# Altium schematic sheet psu_and_discharge.SchDoc: PSU:s
size A3; Organization: GPA Robotics; DocumentNumber: 7; Revision: REV 0; SheetNumber: 7; SheetTotal: 11
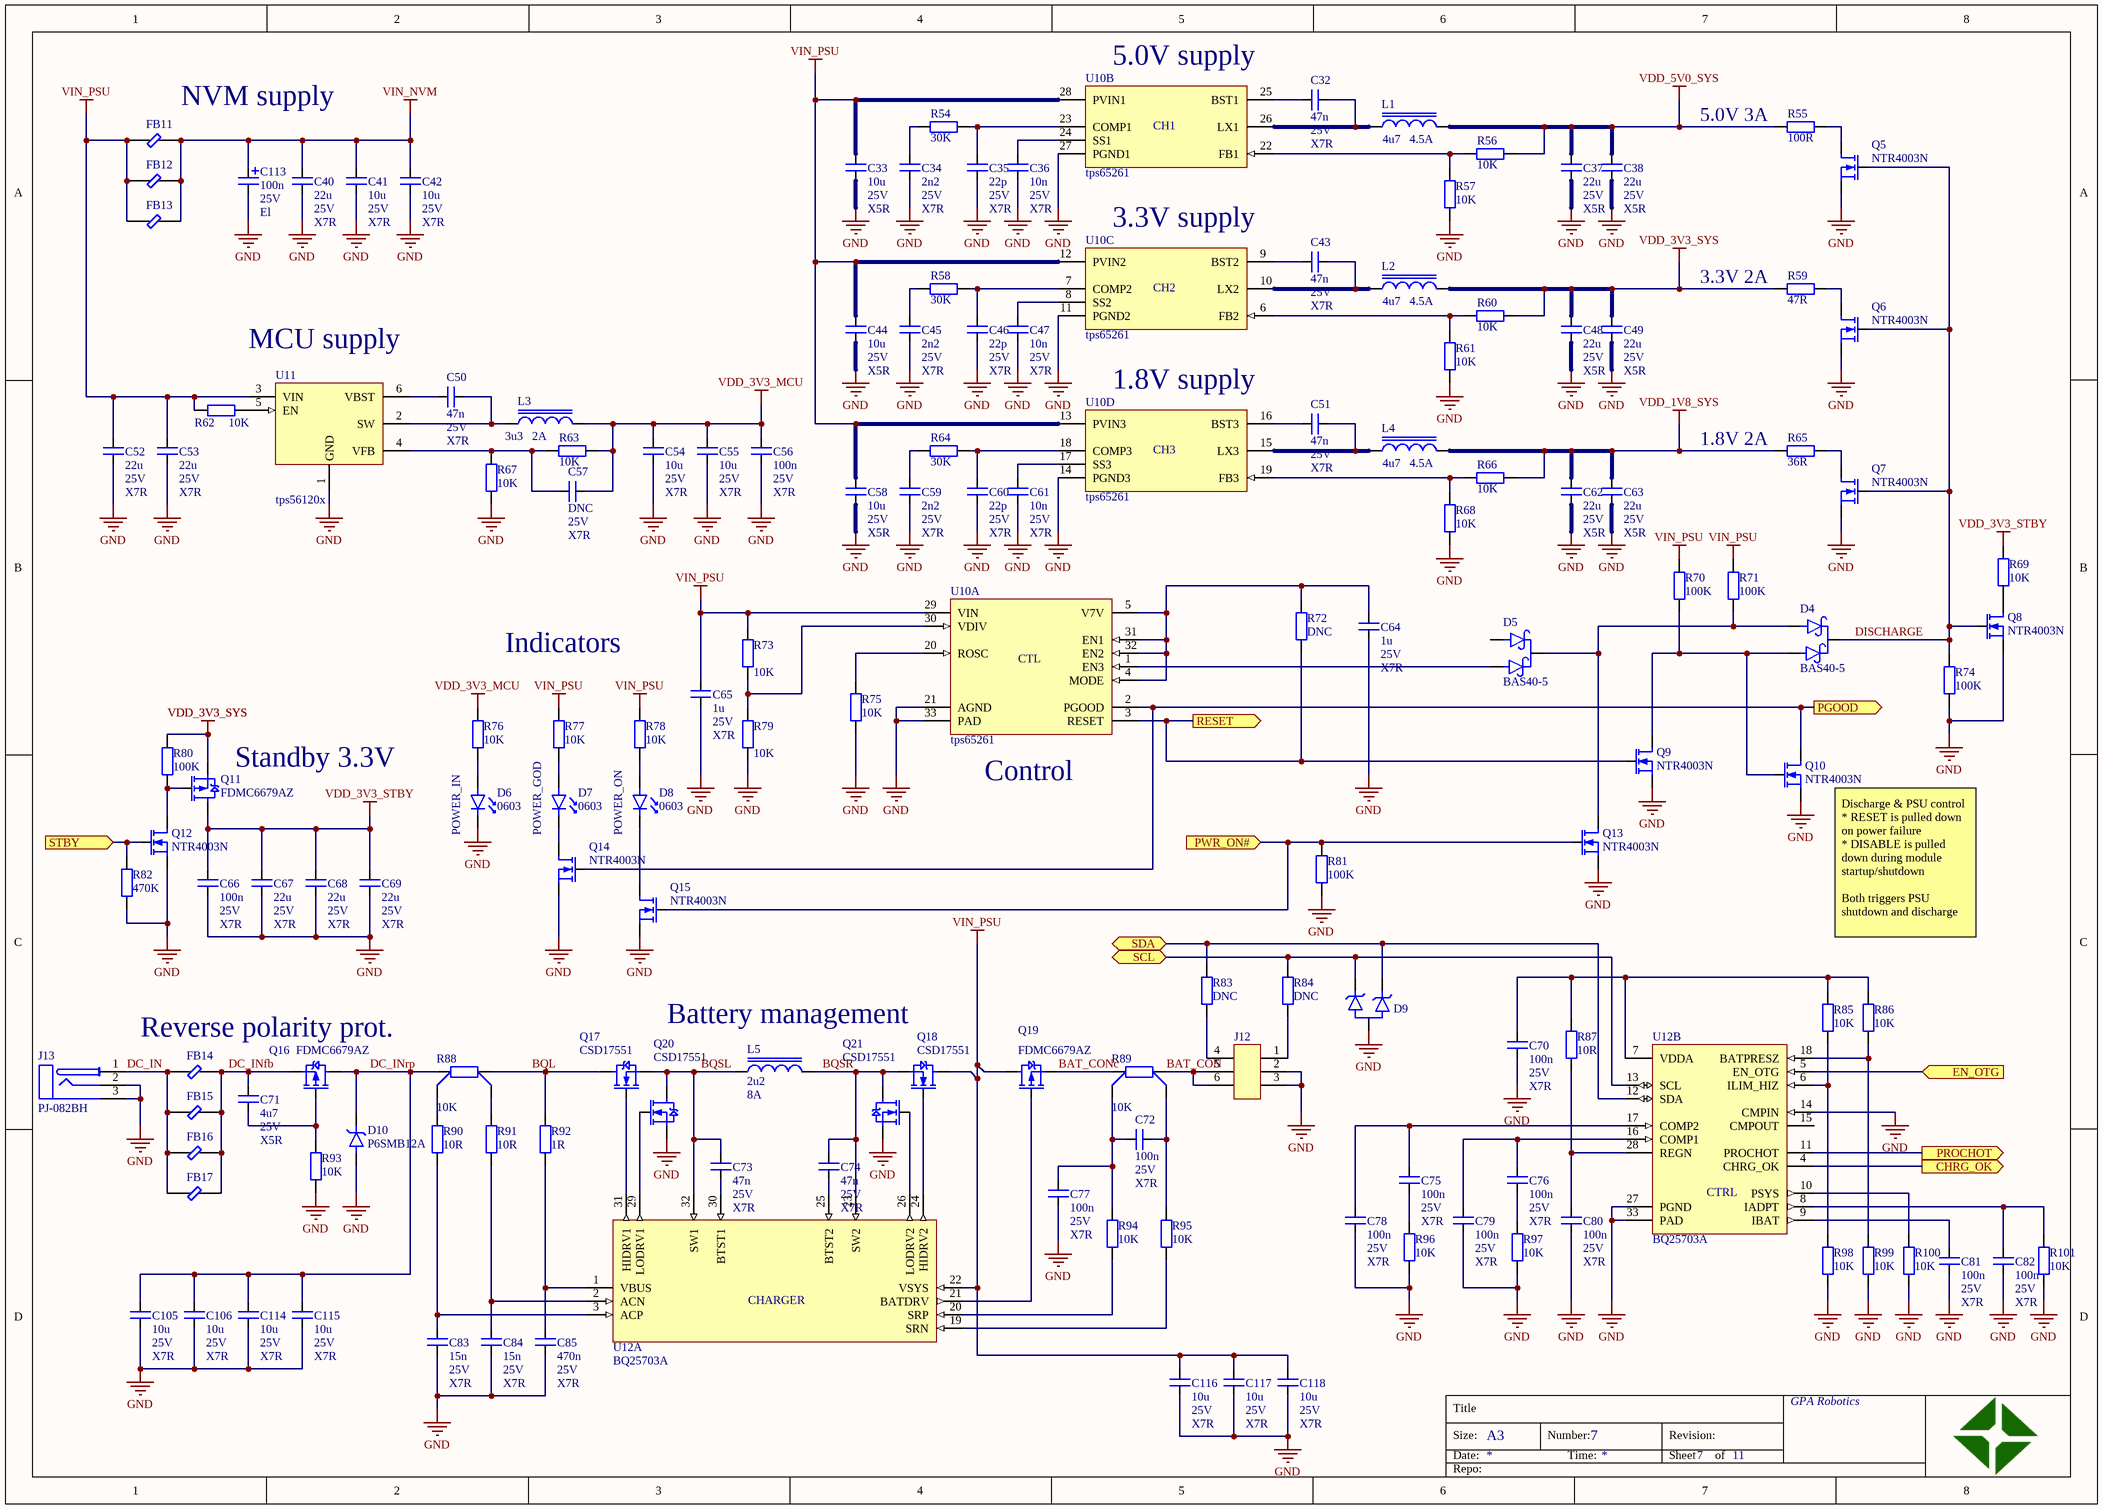
[diagram p0: psu_and_discharge.SchDoc]

## Parts
C32  value 47n  Voltage: 25V  Type: X7R  [C1005[0402]]  (hidden comment: cap)
C33  value 10u  Voltage: 25V  Type: X5R  [C3216[1206]]  (hidden comment: cap)
C34  value 2n2  Voltage: 25V  Type: X7R  [C1005[0402]]  (hidden comment: cap)
C35  value 22p  Voltage: 25V  Type: X7R  [C1005[0402]]  (hidden comment: cap)
C36  value 10n  Voltage: 25V  Type: X7R  [C1005[0402]]  (hidden comment: cap)
C37  value 22u  Voltage: 25V  Type: X5R  [C3216[1206]]  (hidden comment: cap)
C38  value 22u  Voltage: 25V  Type: X5R  [C3216[1206]]  (hidden comment: cap)
C40  value 22u  Voltage: 25V  Type: X7R  [C3216[1206]]  (hidden comment: cap)
C41  value 10u  Voltage: 25V  Type: X7R  [C3216[1206]]  (hidden comment: cap)
C42  value 10u  Voltage: 25V  Type: X7R  [C3216[1206]]  (hidden comment: cap)
C43  value 47n  Voltage: 25V  Type: X7R  [C1005[0402]]  (hidden comment: cap)
C44  value 10u  Voltage: 25V  Type: X5R  [C3216[1206]]  (hidden comment: cap)
C45  value 2n2  Voltage: 25V  Type: X7R  [C1005[0402]]  (hidden comment: cap)
C46  value 22p  Voltage: 25V  Type: X7R  [C1005[0402]]  (hidden comment: cap)
C47  value 10n  Voltage: 25V  Type: X7R  [C1005[0402]]  (hidden comment: cap)
C48  value 22u  Voltage: 25V  Type: X5R  [C3216[1206]]  (hidden comment: cap)
C49  value 22u  Voltage: 25V  Type: X5R  [C3216[1206]]  (hidden comment: cap)
C50  value 47n  Voltage: 25V  Type: X7R  [C1005[0402]]  (hidden comment: cap)
C51  value 47n  Voltage: 25V  Type: X7R  [C1005[0402]]  (hidden comment: cap)
C52  value 22u  Voltage: 25V  Type: X7R  [C3216[1206]]  (hidden comment: cap)
C53  value 22u  Voltage: 25V  Type: X7R  [C3216[1206]]  (hidden comment: cap)
C54  value 10u  Voltage: 25V  Type: X7R  [C3216[1206]]  (hidden comment: cap)
C55  value 10u  Voltage: 25V  Type: X7R  [C3216[1206]]  (hidden comment: cap)
C56  value 100n  Voltage: 25V  Type: X7R  [C1005[0402]]  (hidden comment: cap)
C57  value DNC  Voltage: 25V  Type: X7R  [C1005[0402]]  (hidden comment: cap)
C58  value 10u  Voltage: 25V  Type: X5R  [C3216[1206]]  (hidden comment: cap)
C59  value 2n2  Voltage: 25V  Type: X7R  [C1005[0402]]  (hidden comment: cap)
C60  value 22p  Voltage: 25V  Type: X7R  [C1005[0402]]  (hidden comment: cap)
C61  value 10n  Voltage: 25V  Type: X7R  [C1005[0402]]  (hidden comment: cap)
C62  value 22u  Voltage: 25V  Type: X5R  [C3216[1206]]  (hidden comment: cap)
C63  value 22u  Voltage: 25V  Type: X5R  [C3216[1206]]  (hidden comment: cap)
C64  value 1u  Voltage: 25V  Type: X7R  [C2012[0805]]  (hidden comment: cap)
C65  value 1u  Voltage: 25V  Type: X7R  [C2012[0805]]  (hidden comment: cap)
C66  value 100n  Voltage: 25V  Type: X7R  [C1005[0402]]  (hidden comment: cap)
C67  value 22u  Voltage: 25V  Type: X7R  [C3216[1206]]  (hidden comment: cap)
C68  value 22u  Voltage: 25V  Type: X7R  [C3216[1206]]  (hidden comment: cap)
C69  value 22u  Voltage: 25V  Type: X7R  [C3216[1206]]  (hidden comment: cap)
C70  value 100n  Voltage: 25V  Type: X7R  [C1005[0402]]  (hidden comment: cap)
C71  value 4u7  Voltage: 25V  Type: X5R  [C1005[0402]]  (hidden comment: cap)
C72  value 100n  Voltage: 25V  Type: X7R  [C1005[0402]]  (hidden comment: cap)
C73  value 47n  Voltage: 25V  Type: X7R  [C1005[0402]]  (hidden comment: cap)
C74  value 47n  Voltage: 25V  Type: X7R  [C1005[0402]]  (hidden comment: cap)
C75  value 100n  Voltage: 25V  Type: X7R  [C1005[0402]]  (hidden comment: cap)
C76  value 100n  Voltage: 25V  Type: X7R  [C1005[0402]]  (hidden comment: cap)
C77  value 100n  Voltage: 25V  Type: X7R  [C1005[0402]]  (hidden comment: cap)
C78  value 100n  Voltage: 25V  Type: X7R  [C1005[0402]]  (hidden comment: cap)
C79  value 100n  Voltage: 25V  Type: X7R  [C1005[0402]]  (hidden comment: cap)
C80  value 100n  Voltage: 25V  Type: X7R  [C1005[0402]]  (hidden comment: cap)
C81  value 100n  Voltage: 25V  Type: X7R  [C1005[0402]]  (hidden comment: cap)
C82  value 100n  Voltage: 25V  Type: X7R  [C1005[0402]]  (hidden comment: cap)
C83  value 15n  Voltage: 25V  Type: X7R  [C1005[0402]]  (hidden comment: cap)
C84  value 15n  Voltage: 25V  Type: X7R  [C1005[0402]]  (hidden comment: cap)
C85  value 470n  Voltage: 25V  Type: X7R  [C1005[0402]]  (hidden comment: cap)
C105  value 10u  Voltage: 25V  Type: X7R  [C3216[1206]]  (hidden comment: cap)
C106  value 10u  Voltage: 25V  Type: X7R  [C3216[1206]]  (hidden comment: cap)
C113  value 100n  Voltage: 25V  Type: El  [CAPAE7366X55M]  (hidden comment: pcap)
C114  value 10u  Voltage: 25V  Type: X7R  [C3216[1206]]  (hidden comment: cap)
C115  value 10u  Voltage: 25V  Type: X7R  [C3216[1206]]  (hidden comment: cap)
C116  value 10u  Voltage: 25V  Type: X7R  [C3216[1206]]  (hidden comment: cap)
C117  value 10u  Voltage: 25V  Type: X7R  [C3216[1206]]  (hidden comment: cap)
C118  value 10u  Voltage: 25V  Type: X7R  [C3216[1206]]  (hidden comment: cap)
D4  BAS40-5  [DCC_SOT95P235X110-3N]
D5  BAS40-5  [DCC_SOT95P235X110-3N]
D6  0603  [LEDC1608X06N]
D7  0603  [LEDC1608X06N]
D8  0603  [LEDC1608X06N]
D9  Zener  [DCA_SOT95P235X110-3N]  (value not drawn)
D10  P6SMB12A  [SMA_DIOM5226X22N]
FB11  2506036007Y3  [FBC1608X07N]  (value not drawn)
FB12  2506036007Y3  [FBC1608X07N]  (value not drawn)
FB13  2506036007Y3  [FBC1608X07N]  (value not drawn)
FB14  2506036007Y3  [FBC1608X07N]  (value not drawn)
FB15  2506036007Y3  [FBC1608X07N]  (value not drawn)
FB16  2506036007Y3  [FBC1608X07N]  (value not drawn)
FB17  2506036007Y3  [FBC1608X07N]  (value not drawn)
J12  43045-0600  [molex_microfit_2x6_90deg]  (value not drawn)
J13  PJ-082BH  [CUI_DC_5.5MM_PJ028]
L1  value 4u7  Current: 4.5A  [BOURNS_SRN6045TA-XXX]  (hidden comment: ASPI-0630LR-XXXM-T15)
L2  value 4u7  Current: 4.5A  [BOURNS_SRN6045TA-XXX]  (hidden comment: ASPI-0630LR-XXXM-T15)
L3  value 3u3  Current: 2A  [YUDEN_NRS4018T-XXXMDGJ]  (hidden comment: ASPI-0630LR-XXXM-T15)
L4  value 4u7  Current: 4.5A  [BOURNS_SRN6045TA-XXX]  (hidden comment: ASPI-0630LR-XXXM-T15)
L5  value 2u2  Current: 8A  [VISHAY_IHLM2525CZERXXXM01]  (hidden comment: ASPI-0630LR-XXXM-T15)
Q5  NTR4003N  [NCH_SOT95P237X110-3N]
Q6  NTR4003N  [NCH_SOT95P237X110-3N]
Q7  NTR4003N  [NCH_SOT95P237X110-3N]
Q8  NTR4003N  [NCH_SOT95P237X110-3N]
Q9  NTR4003N  [NCH_SOT95P237X110-3N]
Q10  NTR4003N  [NCH_SOT95P237X110-3N]
Q11  FDMC6679AZ  [NCH_SON65P330X80_HS-9N]
Q12  NTR4003N  [NCH_SOT95P237X110-3N]
Q13  NTR4003N  [NCH_SOT95P237X110-3N]
Q14  NTR4003N  [NCH_SOT95P237X110-3N]
Q15  NTR4003N  [NCH_SOT95P237X110-3N]
Q16  FDMC6679AZ  [NCH_SON65P330X80_HS-9N]
Q17  CSD17551  [NCH_SON65P330X80_HS-9N]
Q18  CSD17551  [NCH_SON65P330X80_HS-9N]
Q19  FDMC6679AZ  [NCH_SON65P330X80_HS-9N]
Q20  CSD17551  [NCH_SON65P330X80_HS-9N]
Q21  CSD17551  [NCH_SON65P330X80_HS-9N]
R54  value 30K  [R1005[0402]]  (hidden comment: res)
R55  value 100R  [R1005[0402]]  (hidden comment: res)
R56  value 10K  [R1005[0402]]  (hidden comment: res)
R57  value 10K  [R1005[0402]]  (hidden comment: res)
R58  value 30K  [R1005[0402]]  (hidden comment: res)
R59  value 47R  [R1005[0402]]  (hidden comment: res)
R60  value 10K  [R1005[0402]]  (hidden comment: res)
R61  value 10K  [R1005[0402]]  (hidden comment: res)
R62  value 10K  [R1005[0402]]  (hidden comment: res)
R63  value 10K  [R1005[0402]]  (hidden comment: res)
R64  value 30K  [R1005[0402]]  (hidden comment: res)
R65  value 36R  [R1005[0402]]  (hidden comment: res)
R66  value 10K  [R1005[0402]]  (hidden comment: res)
R67  value 10K  [R1005[0402]]  (hidden comment: res)
R68  value 10K  [R1005[0402]]  (hidden comment: res)
R69  value 10K  [R1005[0402]]  (hidden comment: res)
R70  value 100K  [R1005[0402]]  (hidden comment: res)
R71  value 100K  [R1005[0402]]  (hidden comment: res)
R72  value DNC  [R1005[0402]]  (hidden comment: res)
R73  value 10K  [R1005[0402]]  (hidden comment: res)
R74  value 100K  [R1005[0402]]  (hidden comment: res)
R75  value 10K  [R1005[0402]]  (hidden comment: res)
R76  value 10K  [R1005[0402]]  (hidden comment: res)
R77  value 10K  [R1005[0402]]  (hidden comment: res)
R78  value 10K  [R1005[0402]]  (hidden comment: res)
R79  value 10K  [R1005[0402]]  (hidden comment: res)
R80  value 100K  [R1005[0402]]  (hidden comment: res)
R81  value 100K  [R1005[0402]]  (hidden comment: res)
R82  value 470K  [R1005[0402]]  (hidden comment: res)
R83  value DNC  [R1005[0402]]  (hidden comment: res)
R84  value DNC  [R1005[0402]]  (hidden comment: res)
R85  value 10K  [R1005[0402]]  (hidden comment: res)
R86  value 10K  [R1005[0402]]  (hidden comment: res)
R87  value 10R  [R1005[0402]]  (hidden comment: res)
R88  value 10K  [4W_R320P320X90-4N]  (hidden comment: res_sens)
R89  value 10K  [4W_R320P320X90-4N]  (hidden comment: res_sens)
R90  value 10R  [R1005[0402]]  (hidden comment: res)
R91  value 10R  [R1005[0402]]  (hidden comment: res)
R92  value 1R  [R1005[0402]]  (hidden comment: res)
R93  value 10K  [R1005[0402]]  (hidden comment: res)
R94  value 10K  [R1005[0402]]  (hidden comment: res)
R95  value 10K  [R1005[0402]]  (hidden comment: res)
R96  value 10K  [R1005[0402]]  (hidden comment: res)
R97  value 10K  [R1005[0402]]  (hidden comment: res)
R98  value 10K  [R1005[0402]]  (hidden comment: res)
R99  value 10K  [R1005[0402]]  (hidden comment: res)
R100  value 10K  [R1005[0402]]  (hidden comment: res)
R101  value 10K  [R1005[0402]]  (hidden comment: res)
U10  tps65261  [TI_QFN50P500X500X100_HS-33M]  (parts A,B,C,D of 4)
U11  tps56120x  [TI_SOT95P280X110-6N]
U12  BQ25703A  [TI_QFN40P400X400X80_HS-33M]  (parts A,B of 2)

## Ports
CHRG_OK (out), EN_OTG (in), PGOOD (out), PROCHOT (out), PWR_ON# (in), RESET (out), SCL (bidir), SDA (bidir), STBY (in)

## Nets
GND: C33.1 C34.1 C35.1 C36.1 C37.1 C38.1 C40.1 C41.1 C42.1 C44.1 C45.1 C46.1 C47.1 C48.1 C49.1 C52.1 C53.1 C54.1 C55.1 C56.1 C58.1 C59.1 C60.1 C61.1 C62.1 C63.1 C64.1 C65.1 C66.1 C67.1 C68.1 C69.1 C70.1 C77.2 C78.2 C79.2 C80.2 C81.1 C82.1 C83.1 C84.1 C85.1 C105.1 C106.1 C113.2 C114.1 C115.1 C116.1 C117.1 C118.1 D6.C D9.A D10.A J12.2 J12.3 J13.2 J13.3 Q5.S Q6.S Q7.S Q8.S Q9.S Q10.S Q12.S Q13.S Q14.S Q15.S Q20.S Q21.S R57.2 R61.2 R67.1 R68.2 R74.1 R75.1 R79.1 R81.2 R82.1 R93.1 R96.1 R97.1 R98.2 R99.2 R100.1 R101.1 U10.11(PGND2) U10.14(PGND3) U10.21(AGND) U10.27(PGND1) U10.33(PAD) U11.1(GND) U12.14(CMPIN) U12.27(PGND) U12.33(PAD)
VDD_1V8_SYS: C62.2 C63.2 L4.2 R65.1 R66.1
VDD_3V3_MCU: C54.2 C55.2 C56.2 C57.1 L3.2 R63.2 R76.2
VDD_3V3_STBY: C66.2 C67.2 C68.2 C69.2 Q11.D R69.2
VDD_3V3_SYS: C48.2 C49.2 L2.2 Q11.S R59.1 R60.1 R80.2
VDD_5V0_SYS: C37.2 C38.2 L1.2 R55.1 R56.1
VIN_NVM: C40.2 C41.2 C42.2 C113.1 FB11.2 FB12.2 FB13.2
VIN_PSU: C33.2 C44.2 C52.2 C53.2 C58.2 C65.2 C116.2 C117.2 C118.2 FB11.1 FB12.1 FB13.1 Q18.D Q19.D R62.1 R70.1 R71.1 R73.2 R77.2 R78.2 U10.12(PVIN2) U10.13(PVIN3) U10.28(PVIN1) U10.29(VIN) U11.3(VIN) U12.22(VSYS)
BAT_CON: J12.5 J12.6 R89.2
BAT_CONc: Q19.S R89.1
BQL: Q17.D R88.1 R92.2
BQSL: C73.2 L5.1 Q17.S Q20.D U12.32(SW1)
BQSR: C74.2 L5.2 Q18.S Q21.D U12.23(SW2)
CHRG_OK: U12.4(CHRG_OK) ; port CHRG_OK
DC_IN: FB14.1 FB15.1 FB16.1 FB17.1 J13.1
DC_INfb: C71.2 FB14.2 FB15.2 FB16.2 FB17.2 Q16.S
DC_INrp: C105.2 C106.2 C114.2 C115.2 D10.C Q16.D R88.2
DISCHARGE: D4.C Q5.G Q6.G Q7.G Q8.G R74.2
EN_OTG: U12.5(EN_OTG) ; port EN_OTG
PGOOD: Q10.D Q14.G U10.2(PGOOD) ; port PGOOD
PROCHOT: U12.11(PROCHOT) ; port PROCHOT
PWR_ON#: Q13.G Q15.G R81.1 ; port PWR_ON#
RESET: Q9.G R72.2 U10.3(RESET) ; port RESET
SCL: D9.C2 R84.1 U12.13(SCL) ; port SCL
SDA: D9.C1 R83.1 U12.12(SDA) ; port SDA
STBY: Q12.G R82.2 ; port STBY
NetC32_1: C32.1 L1.1 U10.26(LX1)
NetC32_2: C32.2 U10.25(BST1)
NetC34_2: C34.2 R54.1
NetC35_2: C35.2 R54.2 U10.23(COMP1)
NetC36_2: C36.2 U10.24(SS1)
NetC43_1: C43.1 L2.1 U10.10(LX2)
NetC43_2: C43.2 U10.9(BST2)
NetC45_2: C45.2 R58.1
NetC46_2: C46.2 R58.2 U10.7(COMP2)
NetC47_2: C47.2 U10.8(SS2)
NetC50_1: C50.1 L3.1 U11.2(SW)
NetC50_2: C50.2 U11.6(VBST)
NetC51_1: C51.1 L4.1 U10.15(LX3)
NetC51_2: C51.2 U10.16(BST3)
NetC57_2: C57.2 R63.1 R67.2 U11.4(VFB)
NetC59_2: C59.2 R64.1
NetC60_2: C60.2 R64.2 U10.18(COMP3)
NetC61_2: C61.2 U10.17(SS3)
NetC64_2: C64.2 R72.1 U10.4(MODE) U10.5(V7V) U10.31(EN1) U10.32(EN2)
NetC70_2: C70.2 R85.1 R86.1 R87.2 U12.7(VDDA)
NetC71_1: C71.1 Q16.G R93.2
NetC72_1: C72.1 R89.S2 R95.2
NetC72_2: C72.2 C77.1 R89.S1 R94.2
NetC73_1: C73.1 U12.30(BTST1)
NetC74_1: C74.1 U12.25(BTST2)
NetC75_1: C75.1 C78.1 U12.17(COMP2)
NetC75_2: C75.2 R96.2
NetC76_1: C76.1 C79.1 U12.16(COMP1)
NetC76_2: C76.2 R97.2
NetC80_1: C80.1 R87.1 U12.28(REGN)
NetC81_2: C81.2 U12.9(IBAT)
NetC82_2: C82.2 R101.2 U12.8(IADPT)
NetC83_2: C83.2 R90.1 U12.3(ACP)
NetC84_2: C84.2 R91.1 U12.2(ACN)
NetC85_2: C85.2 R92.1 U12.1(VBUS)
NetD4_A1: D4.A1 D5.C Q13.D R71.2
NetD4_A2: D4.A2 Q9.D Q10.G R70.2
NetD5_A2: D5.A2 U10.1(EN3)
NetD6_A: D6.A R76.1
NetD7_A: D7.A R77.1
NetD7_C: D7.C Q14.D
NetD8_A: D8.A R78.1
NetD8_C: D8.C Q15.D
NetJ12_1: J12.1 R84.2
NetJ12_4: J12.4 R83.2
NetQ5_D: Q5.D R55.2
NetQ6_D: Q6.D R59.2
NetQ7_D: Q7.D R65.2
NetQ8_D: Q8.D R69.1
NetQ11_G: Q11.G Q12.D R80.1
NetQ17_G: Q17.G U12.31(HIDRV1)
NetQ18_G: Q18.G U12.24(HIDRV2)
NetQ19_G: Q19.G U12.21(BATDRV)
NetQ20_G: Q20.G U12.29(LODRV1)
NetQ21_G: Q21.G U12.26(LODRV2)
NetR56_2: R56.2 R57.1 U10.22(FB1)
NetR60_2: R60.2 R61.1 U10.6(FB2)
NetR62_2: R62.2 U11.5(EN)
NetR66_2: R66.2 R68.1 U10.19(FB3)
NetR73_1: R73.1 R79.2 U10.30(VDIV)
NetR75_2: R75.2 U10.20(ROSC)
NetR85_2: R85.2 R98.1 U12.6(ILIM_HIZ)
NetR86_2: R86.2 R99.1 U12.18(BATPRESZ)
NetR88_S1: R88.S1 R91.2
NetR88_S2: R88.S2 R90.2
NetR94_1: R94.1 U12.20(SRP)
NetR95_1: R95.1 U12.19(SRN)
NetR100_2: R100.2 U12.10(PSYS)

Not connected (* = marked no-connect by the designer): D5 A1; U12 15(CMPOUT)

## Notes on the sheet
- (near FB11) NVM supply
- (near U10) 5.0V supply
- (near R55) 5.0V 3A
- (near U10) 3.3V supply
- (near R59) 3.3V 2A
- MCU supply
- (near U10) 1.8V supply
- (near R65) 1.8V 2A
- Indicators
- (near Q11) Standby 3.3V
- (near U10) Control
- (near D6) POWER_IN
- (near D7) POWER_GOD
- (near D8) POWER_ON
- (near Q10) Discharge & PSU control
  * RESET is pulled down on power failure
  * DISABLE is pulled down during module startup/shutdown
  Both triggers PSU shutdown and discharge
- Reverse polarity prot.
- Battery management
- Title
- Size:
- Date:
- A3
- Number:
- Time:
- Revision:
- Sheet
- of
- Repo:
- (in symbol bq25703a, part A) CHARGER
- (in symbol bq25703a, part B) CTRL
- (in symbol tps65261, part A) CTL
- (in symbol tps65261, part B) CH1
- (in symbol tps65261, part C) CH2
- (in symbol tps65261, part D) CH3

## Library data of the parts
C32-C38 C40-C85 C105 C106 C114-C118 = cap: Capacitor; Manufacturer: *; Series: *
C113 = pcap: Polarized capacitor; Manufacturer: *; Series: *
D4 D5 = diode_dual_cc
D6-D8 = diode_led
D9 = diode_dual_ca_zener: Voltage: 3.6V
D10 = diode_tvs_unidirectional
FB11-FB17 = ferrite_bead: Ferrite bead
J12 = microfit_2x3
J13 = dc_jack_shielded: mouser#: 490-PJ-082BH; digikey#: CP-082BHCT-ND
L1-L5 = ind
Q5-Q10 Q12-Q15 = nch_mosfet
Q11 Q16 Q19 = pch_mosfet_diode
Q17 Q18 Q20 Q21 = nch_mosfet_diode
R54-R87 R90-R101 = res: Resistor
R88 R89 = res_sens: Resistor